# EAGLE design Comm (EAGLE 9.0.0)
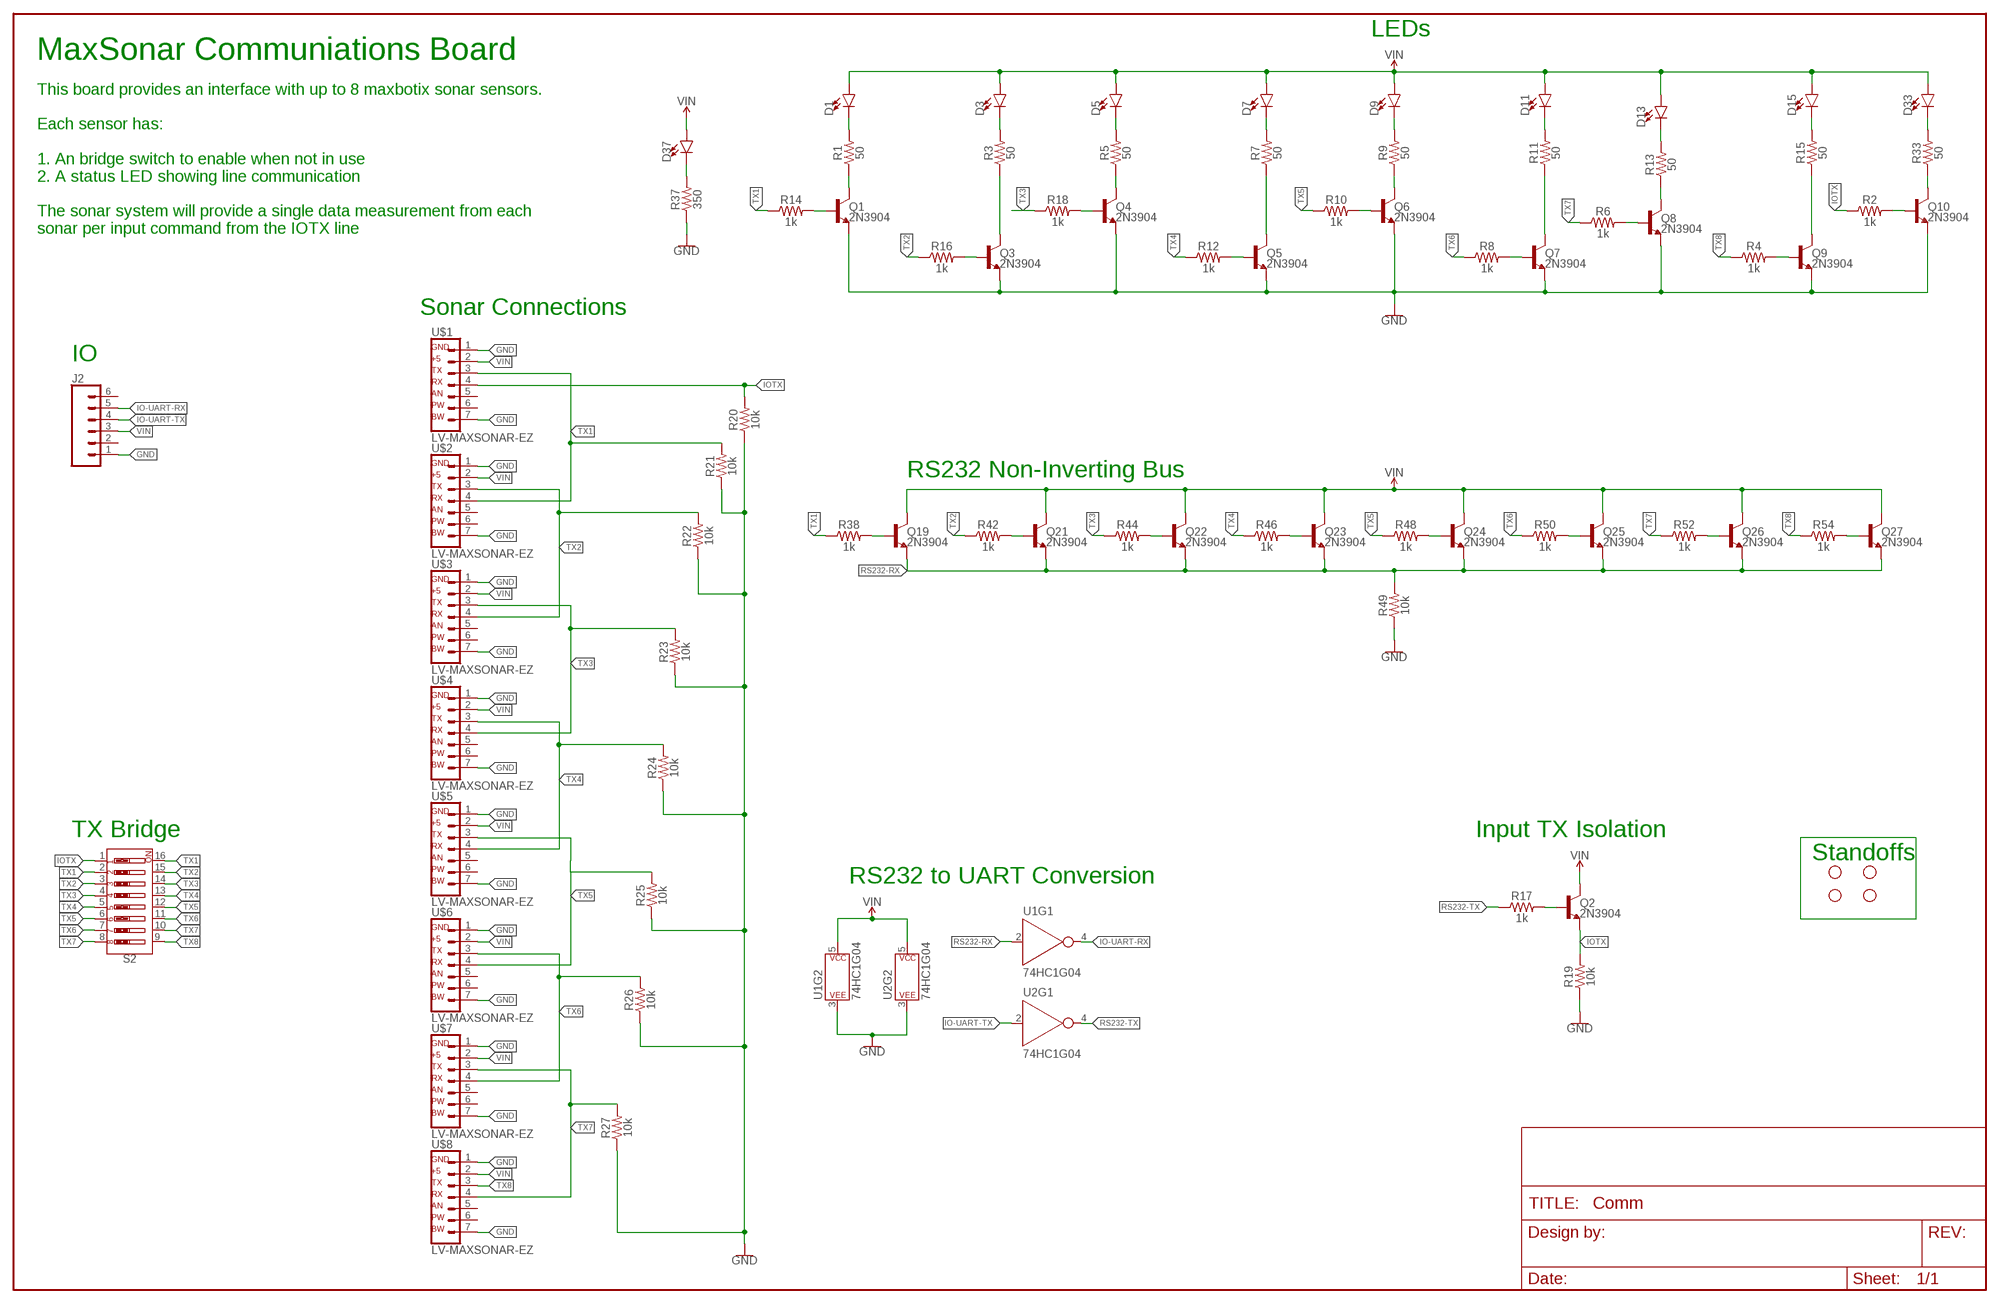
[diagram p0: schematic, sheet 1]

## Parts
D1  LED0603  [LED-0603]
D3  LED0603  [LED-0603]
D5  LED0603  [LED-0603]
D7  LED0603  [LED-0603]
D9  LED0603  [LED-0603]
D11  LED0603  [LED-0603]
D13  LED0603  [LED-0603]
D15  LED0603  [LED-0603]
D33  LED0603  [LED-0603]
D37  LED0603  [LED-0603]
FRAME1  FRAME-LEDGER  [CREATIVE_COMMONS]
H1  STAND-OFF  [STAND-OFF]
H2  STAND-OFF  [STAND-OFF]
H3  STAND-OFF  [STAND-OFF]
H4  STAND-OFF  [STAND-OFF]
J2  CONN_06POLAR  [MOLEX-1X6]
Q1  2N3904  TRANS_NPN-MMBTA42  [SOT23-3]
Q2  2N3904  TRANS_NPN-MMBTA42  [SOT23-3]
Q3  2N3904  TRANS_NPN-MMBTA42  [SOT23-3]
Q4  2N3904  TRANS_NPN-MMBTA42  [SOT23-3]
Q5  2N3904  TRANS_NPN-MMBTA42  [SOT23-3]
Q6  2N3904  TRANS_NPN-MMBTA42  [SOT23-3]
Q7  2N3904  TRANS_NPN-MMBTA42  [SOT23-3]
Q8  2N3904  TRANS_NPN-MMBTA42  [SOT23-3]
Q9  2N3904  TRANS_NPN-MMBTA42  [SOT23-3]
Q10  2N3904  TRANS_NPN-MMBTA42  [SOT23-3]
Q19  2N3904  TRANS_NPN-MMBTA42  [SOT23-3]
Q21  2N3904  TRANS_NPN-MMBTA42  [SOT23-3]
Q22  2N3904  TRANS_NPN-MMBTA42  [SOT23-3]
Q23  2N3904  TRANS_NPN-MMBTA42  [SOT23-3]
Q24  2N3904  TRANS_NPN-MMBTA42  [SOT23-3]
Q25  2N3904  TRANS_NPN-MMBTA42  [SOT23-3]
Q26  2N3904  TRANS_NPN-MMBTA42  [SOT23-3]
Q27  2N3904  TRANS_NPN-MMBTA42  [SOT23-3]
R1  50  RESISTOR0805  [0805]
R2  1k  RESISTOR0805  [0805]
R3  50  RESISTOR0805  [0805]
R4  1k  RESISTOR0805  [0805]
R5  50  RESISTOR0805  [0805]
R6  1k  RESISTOR0805  [0805]
R7  50  RESISTOR0805  [0805]
R8  1k  RESISTOR0805  [0805]
R9  50  RESISTOR0805  [0805]
R10  1k  RESISTOR0805  [0805]
R11  50  RESISTOR0805  [0805]
R12  1k  RESISTOR0805  [0805]
R13  50  RESISTOR0805  [0805]
R14  1k  RESISTOR0805  [0805]
R15  50  RESISTOR0805  [0805]
R16  1k  RESISTOR0805  [0805]
R17  1k  RESISTOR0805  [0805]
R18  1k  RESISTOR0805  [0805]
R19  10k  RESISTOR0805  [0805]
R20  10k  RESISTOR0805  [0805]
R21  10k  RESISTOR0805  [0805]
R22  10k  RESISTOR0805  [0805]
R23  10k  RESISTOR0805  [0805]
R24  10k  RESISTOR0805  [0805]
R25  10k  RESISTOR0805  [0805]
R26  10k  RESISTOR0805  [0805]
R27  10k  RESISTOR0805  [0805]
R33  50  RESISTOR0805  [0805]
R37  350  RESISTOR0805  [0805]
R38  1k  RESISTOR0805  [0805]
R42  1k  RESISTOR0805  [0805]
R44  1k  RESISTOR0805  [0805]
R46  1k  RESISTOR0805  [0805]
R48  1k  RESISTOR0805  [0805]
R49  10k  RESISTOR0805  [0805]
R50  1k  RESISTOR0805  [0805]
R52  1k  RESISTOR0805  [0805]
R54  1k  RESISTOR0805  [0805]
S2  DIP-08-PTH  [DIPSWITCH-08]
U1  74HC1G04  [SOT353]
U2  74HC1G04  [SOT353]
U$1  LV-MAXSONAR-EZ  [1X07]
U$2  LV-MAXSONAR-EZ  [1X07]
U$3  LV-MAXSONAR-EZ  [1X07]
U$4  LV-MAXSONAR-EZ  [1X07]
U$5  LV-MAXSONAR-EZ  [1X07]
U$6  LV-MAXSONAR-EZ  [1X07]
U$7  LV-MAXSONAR-EZ  [1X07]
U$8  LV-MAXSONAR-EZ  [1X07]

## Nets
GND: J2.1 Q1.2(E) Q3.2(E) Q4.2(E) Q5.2(E) Q6.2(E) Q7.2(E) Q8.2(E) Q9.2(E) Q10.2(E) R19.1 R20.1 R21.1 R22.1 R23.1 R24.1 R25.1 R26.1 R27.1 R37.1 R49.1 U1.3(P$V-) U2.3(P$V-) U$1.1(GND) U$1.7(BW) U$2.1(GND) U$2.7(BW) U$3.1(GND) U$3.7(BW) U$4.1(GND) U$4.7(BW) U$5.1(GND) U$5.7(BW) U$6.1(GND) U$6.7(BW) U$7.1(GND) U$7.7(BW) U$8.1(GND) U$8.7(BW)
IO-UART-RX: J2.5 U1.4(Y)
IO-UART-TX: J2.4 U2.2(A)
IOTX: Q2.2(E) R2.1 R19.2 R20.2 S2.1 U$1.4(RX)
N$1: D1.C R1.2
N$2: Q1.3(C) R1.1
N$3: D3.C R3.2
N$4: Q3.3(C) R3.1
N$5: D5.C R5.2
N$6: Q4.3(C) R5.1
N$7: D7.C R7.2
N$8: Q5.3(C) R7.1
N$9: D9.C R9.2
N$10: Q6.3(C) R9.1
N$11: D11.C R11.2
N$12: Q7.3(C) R11.1
N$13: D13.C R13.2
N$14: Q8.3(C) R13.1
N$15: D15.C R15.2
N$16: Q9.3(C) R15.1
N$17: Q2.1(B) R17.2
N$18: Q10.3(C) R33.1
N$20: Q10.1(B) R2.2
N$22: Q9.1(B) R4.2
N$24: Q8.1(B) R6.2
N$26: Q7.1(B) R8.2
N$28: Q6.1(B) R10.2
N$30: Q5.1(B) R12.2
N$32: Q1.1(B) R14.2
N$33: D33.C R33.2
N$34: Q3.1(B) R16.2
N$37: D37.C R37.2
N$38: Q19.1(B) R38.2
N$61: Q21.1(B) R42.2
N$63: Q4.1(B) R18.2
N$65: Q22.1(B) R44.2
N$68: Q23.1(B) R46.2
N$71: Q24.1(B) R48.2
N$74: Q25.1(B) R50.2
N$77: Q26.1(B) R52.2
N$80: Q27.1(B) R54.2
RS232-RX: Q19.2(E) Q21.2(E) Q22.2(E) Q23.2(E) Q24.2(E) Q25.2(E) Q26.2(E) Q27.2(E) R49.2 U1.2(A)
RS232-TX: R17.1 U2.4(Y)
TX1: R14.1 R21.2 R38.1 S2.2 S2.16 U$1.3(TX) U$2.4(RX)
TX2: R16.1 R22.2 R42.1 S2.3 S2.15 U$2.3(TX) U$3.4(RX)
TX3: R18.1 R23.2 R44.1 S2.4 S2.14 U$3.3(TX) U$4.4(RX)
TX4: R12.1 R24.2 R46.1 S2.5 S2.13 U$4.3(TX) U$5.4(RX)
TX5: R10.1 R25.2 R48.1 S2.6 S2.12 U$5.3(TX) U$6.4(RX)
TX6: R8.1 R26.2 R50.1 S2.7 S2.11 U$6.3(TX) U$7.4(RX)
TX7: R6.1 R27.2 R52.1 S2.8 S2.10 U$7.3(TX) U$8.4(RX)
TX8: R4.1 R54.1 S2.9 U$8.3(TX)
VIN: D1.A D3.A D5.A D7.A D9.A D11.A D13.A D15.A D33.A D37.A J2.3 Q2.3(C) Q19.3(C) Q21.3(C) Q22.3(C) Q23.3(C) Q24.3(C) Q25.3(C) Q26.3(C) Q27.3(C) U1.5(P$V+) U2.5(P$V+) U$1.2(+5) U$2.2(+5) U$3.2(+5) U$4.2(+5) U$5.2(+5) U$6.2(+5) U$7.2(+5) U$8.2(+5)
Unconnected: J2.2 J2.6 U$1.5(AN) U$1.6(PW) U$2.5(AN) U$2.6(PW) U$3.5(AN) U$3.6(PW) U$4.5(AN) U$4.6(PW) U$5.5(AN) U$5.6(PW) U$6.5(AN) U$6.6(PW) U$7.5(AN) U$7.6(PW) U$8.5(AN) U$8.6(PW)

## Notes on the sheet
- LEDs
- MaxSonar Communiations Board
- This board provides an interface with up to 8 maxbotix sonar sensors. 
  
  Each sensor has:
  
  1. An bridge switch to enable when not in use
  2. A status LED showing line communication
  
  The sonar system will provide a single data measurement from each 
  sonar per input command from the IOTX line
- Sonar Connections
- IO
- RS232 Non-Inverting Bus
- TX Bridge | Input TX Isolation
- Standoffs
- RS232 to UART Conversion

## Library data of the parts
D1 D3 D5 D7 D9 D11 D13 D15 D33 D37 = SparkFun-LED:LED: LED (Generic) Standard schematic elements and footprints for 5mm, 3mm, 1206, and 0603 sized LEDs. Generic LEDs with no color specified.
FRAME1 = SparkFun-Aesthetics:FRAME-LEDGER: Schematic Frame - Ledger Standard 11x14 US Ledger frame
H1-H4 = SparkFun-Hardware:STAND-OFF: Stand Off Drill holes for mechanically mounting via screws, standoffs, etc. Note: Use the keepout ring to avoid running the screw head into surrounding components. Variant Overviews STAND-OFF - Mechanical footprint for a #4 phillips button head screw. STAND-OFF-TIGHT - Mechanical footprint for a #4 phillips button head screw, Example SparkFun Products Screw - Phillips Head (1/4", 4-40, 10 pack) <https://www.sparkfun.com/products/10453> (PRT-10453) Screw - Phillips Head (1/2", 4-40, 10 pack) <https://www.sparkfun.com/products/10452> (PRT-10452) Screw - Phillips Head (3/4", 4-40, 10 pack) <https://www.sparkfun.com/products/10451> (PRT-10451) Screw - Phillips Head (1", 4-40, 10 pack) <https://www.sparkfun.com/products/10450> (PRT-10450)
J2 = SparkFun-Connectors:CONN_06: Multi connection point. Often used as Generic Header-pin footprint for 0.1 inch spaced/style header connections On any of the 0.1 inch spaced packages, you can populate with these: Break Away Headers - Straight <https://www.sparkfun.com/products/116> (PRT-00116) Break Away Male Headers - Right Angle <https://www.sparkfun.com/products/553> (PRT-00553) Female Headers <https://www.sparkfun.com/products/115> (PRT-00115) Break Away Headers - Machine Pin <https://www.sparkfun.com/products/117> (PRT-00117) Break Away Female Headers - Swiss Machine Pin <https://www.sparkfun.com/products/743> (PRT-00743) Arduino Stackable Header - 6 Pin <https://www.sparkfun.com/products/9280> (PRT-09280) For SCREWTERMINALS and SPRING TERMINALS visit here: Screw Terimnals on SparkFun.com <https://www.sparkfun.com/search/results?term=Screw+Terminals> (5mm/3.5mm/2.54mm spacing) This device is also useful as a general connection point to wire up your design to another part of your project. Our various solder wires solder well into these plated through hole pads. Hook-Up Wire - Assortment (Stranded, 22 AWG) <https://www.sparkfun.com/products/11375> (PRT-11375) Hook-Up Wire - Assortment (Solid Core, 22 AWG) <https://www.sparkfun.com/products/11367> (PRT-11367) View the entire wire category on our website here <https://www.sparkfun.com/categories/141>
Q1-Q10 Q19 Q21-Q27 = SparkFun-DiscreteSemi:TRANS_NPN: NPN transistor Current controlled devices typically used to amplify current or used as a switch. BC547 - COM-08928 <http://www.sparkfun.com/products/8928> (TO-92 45V 100mA) (1.Collector 2.Base 3.Emitter) 2N3904 - COM-00521 <http://www.sparkfun.com/products/521> (TO-92 40V 200mA) (1.Emitter 2.Base 3.Collector) P2N2222A - COM-12852 <http://www.sparkfun.com/products/12852> (TO-92 40V 600mA) (1.Collector 2.Base 3.Emitter); PROD_ID: TRANS-09116; VALUE: 500mA/300V
R1-R27 R33 R37 R38 R42 R44 R46 R48-R50 R52 R54 = SparkFun-Resistors:RESISTOR: Generic Resistor Package
S2 = SparkFun-Switches:DIP-08: 8-Position DIP Switch 8-circuit DIP (dual inline package) switch. Commonly used to physcially set a circuit's behavior. SparkFun Products DIP Switch - 8 Position <https://www.sparkfun.com/products/8034> (COM-08034); PROD_ID: SWCH-12197; SF_SKU: COM-08034
U1 U2 = SparkFun-IC-Logic:74*1G04: Single Inverter IC NOT GATE INVERTER SNGL 1IN SOT353 Supply: 1.65V to 5.5V Datasheet <http://diodes.com/datasheets/74LVC1G04.pdf> SparkFun Products SparkFun Stepoko <https://www.sparkfun.com/products/13899> (ROB-13899) SparkFun CryptoShield <https://www.sparkfun.com/products/13183> (DEV-13183) SparkFun LogicBlocks Kit <https://www.sparkfun.com/products/11006> (KIT-11006) SparkFun ArduMoto <https://www.sparkfun.com/products/9815> (DEV-09815); PROD_ID: COMP-08268
U$1-U$8 = Comm:LV-MAXSONAR-EZ

## Net classes
0 default: width 0.152 mm, drill 0.254 mm, clearance 0.152 mm

## Board
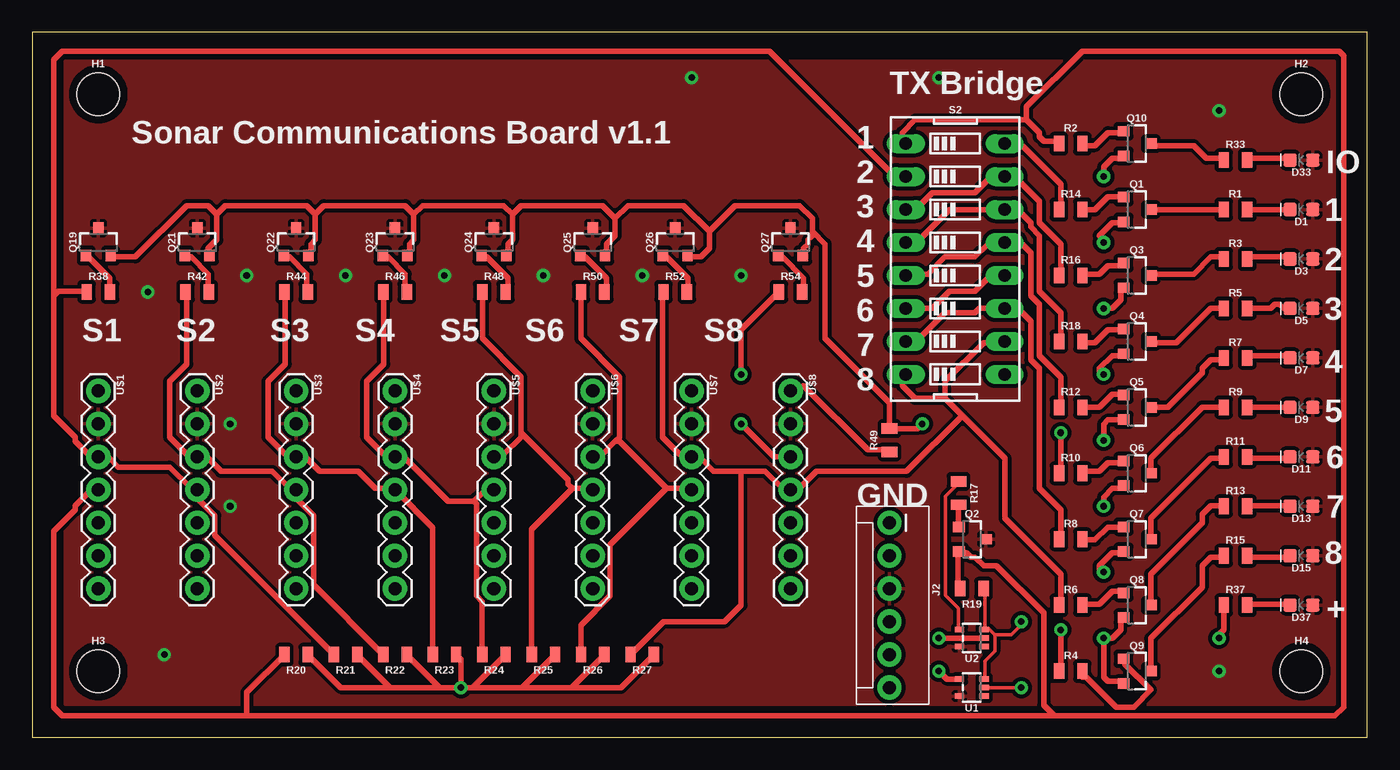
[diagram p1: board, top side]
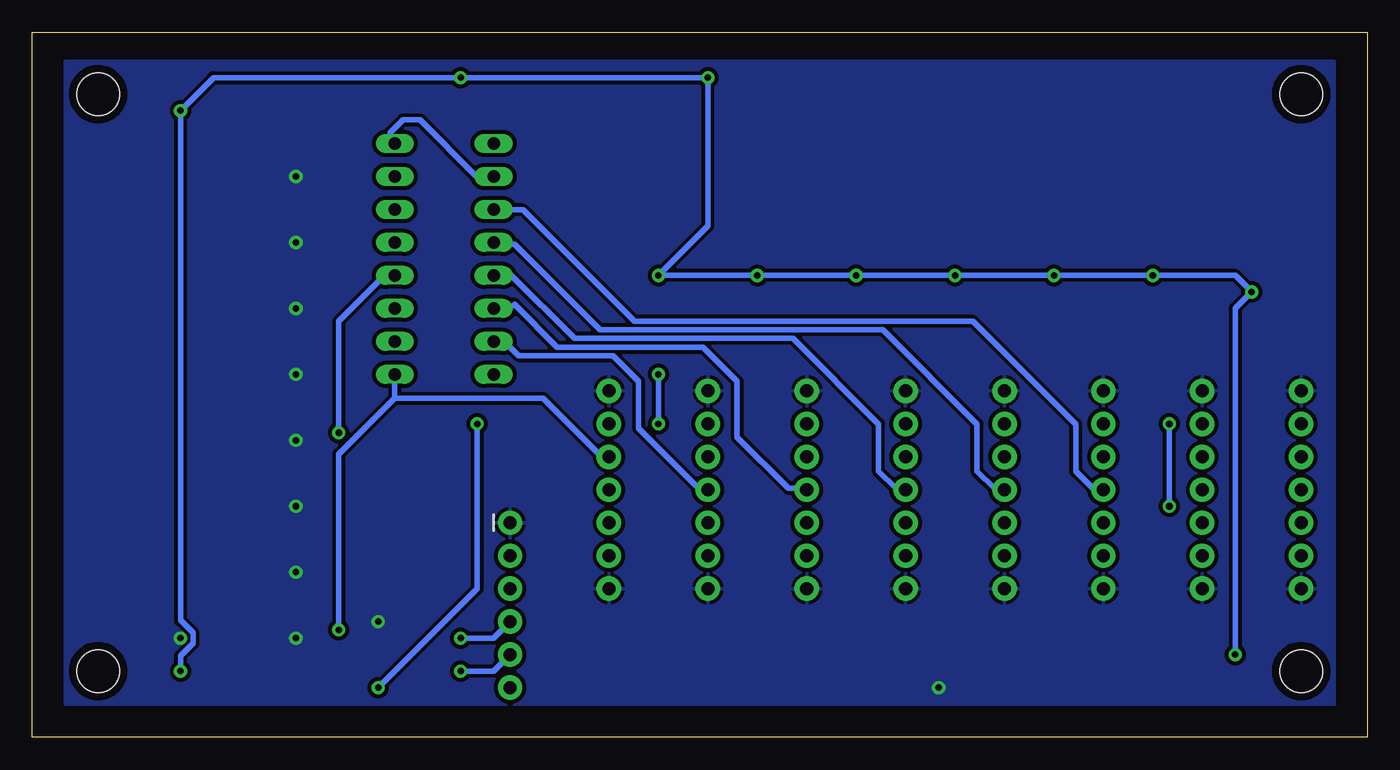
[diagram p2: board, bottom side, seen from below]

Size 102.85 x 54.28 mm. Coordinates in mm from the lower left corner, seen from the top.
Outline: 0,0 102.85,0 102.85,54.28 0,54.28 0,0
Copper layers (1*16): Top 0.035mm / dielectric 1.5mm / Bottom 0.035mm
Design rules "SparkFun-2-layer-STANDARD *": minimum track width 10mil, minimum drill 20mil, track to track 10mil, track to pad 8mil, pad to pad 8mil, via to via 10mil, smd to smd 8mil, copper to edge 8mil, drill to drill 8mil, minimum pad ring 10mil, minimum via ring 10mil, stop-mask expansion 4mil, vias tented up to drill 25mil, thermal gap 10mil

### Footprints (pad centres in the part's own frame; a part is rotated, then mirrored left to right if it is on the bottom)
LED-0603 = smd 1 x 1: A -0.877,0; C 0.877,0
STAND-OFF = hole 3.302: 0,0
MOLEX-1X6 = drill 1.016 pad 1.88: 1 0,0; 2 2.54,0; 3 5.08,0; 4 7.62,0; 5 10.16,0; 6 12.7,0
SOT23-3 = smd 0.8 x 0.9: 1 -0.95,-1; 2 0.95,-1; 3 0,1.1
0805 = smd 0.8 x 1.2: 1 -0.9,0; 2 0.9,0
DIPSWITCH-08 = drill 0.97 long: 1 -8.89,-3.81; 2 -6.35,-3.81; 3 -3.81,-3.81; 4 -1.27,-3.81; 5 1.27,-3.81; 6 3.81,-3.81; 7 6.35,-3.81; 8 8.89,-3.81; 9 8.89,3.81; 10 6.35,3.81; 11 3.81,3.81; 12 1.27,3.81; 13 -1.27,3.81; 14 -3.81,3.81; 15 -6.35,3.81; 16 -8.89,3.81
SOT353 = smd 0.42 x 0.7: 1 -0.65,-0.95; 2 0,-0.95; 3 0.65,-0.95; 4 0.65,0.95; 5 -0.65,0.95
1X07 = drill 1.016 pad 1.88: 1 0,0; 2 2.54,0; 3 5.08,0; 4 7.62,0; 5 10.16,0; 6 12.7,0; 7 15.24,0

### Placement (x,y rotation side)
D1  97.79,40.64 180 top
D3  97.79,36.83 180 top
D5  97.79,33.02 180 top
D7  97.79,29.21 180 top
D9  97.79,25.4 180 top
D11  97.79,21.59 180 top
D13  97.79,17.78 180 top
D15  97.79,13.97 180 top
D33  97.79,44.45 180 top
D37  97.79,10.16 180 top
FRAME1  99.06,40.64 180 top
H1  5.08,49.53 0 top
H2  97.79,49.53 0 top
H3  5.08,5.08 0 top
H4  97.79,5.08 0 top
J2  66.04,16.51 270 top
Q1  85.09,40.64 270 top
Q2  72.39,15.24 270 top
Q3  85.09,35.56 270 top
Q4  85.09,30.48 270 top
Q5  85.09,25.4 270 top
Q6  85.09,20.32 270 top
Q7  85.09,15.24 270 top
Q8  85.09,10.16 270 top
Q9  85.09,5.08 270 top
Q10  85.09,45.72 270 top
Q19  5.08,38.1 0 top
Q21  12.7,38.1 0 top
Q22  20.32,38.1 0 top
Q23  27.94,38.1 0 top
Q24  35.56,38.1 0 top
Q25  43.18,38.1 0 top
Q26  49.53,38.1 0 top
Q27  58.42,38.1 0 top
R1  92.71,40.64 0 top
R2  80.01,45.72 0 top
R3  92.71,36.83 0 top
R4  80.01,5.08 0 top
R5  92.71,33.02 0 top
R6  80.01,10.16 0 top
R7  92.71,29.21 0 top
R8  80.01,15.24 0 top
R9  92.71,25.4 0 top
R10  80.01,20.32 0 top
R11  92.71,21.59 0 top
R12  80.01,25.4 0 top
R13  92.71,17.78 0 top
R14  80.01,40.64 0 top
R15  92.71,13.97 0 top
R16  80.01,35.56 0 top
R17  71.37,18.8 270 top
R18  80.01,30.48 0 top
R19  72.39,11.43 180 top
R20  20.32,6.35 180 top
R21  24.13,6.35 180 top
R22  27.94,6.35 180 top
R23  31.75,6.35 180 top
R24  35.56,6.35 180 top
R25  39.37,6.35 180 top
R26  43.18,6.35 180 top
R27  46.99,6.35 180 top
R33  92.71,44.45 0 top
R37  92.71,10.16 0 top
R38  5.08,34.29 0 top
R42  12.7,34.29 0 top
R44  20.32,34.29 0 top
R46  27.94,34.29 0 top
R48  35.56,34.29 0 top
R49  66.04,22.86 90 top
R50  43.18,34.29 0 top
R52  49.53,34.29 0 top
R54  58.42,34.29 0 top
S2  71.12,36.83 270 top
U1  72.39,3.81 90 top
U2  72.39,7.62 90 top
U$1  5.08,26.67 270 top
U$2  12.7,26.67 270 top
U$3  20.32,26.67 270 top
U$4  27.94,26.67 270 top
U$5  35.56,26.67 270 top
U$6  43.18,26.67 270 top
U$7  50.8,26.67 270 top
U$8  58.42,26.67 270 top

### Tracks (layer width: path | path; a pad name or v marks a point on that pad's centre or on a via)
GND  (via drill 0.51)
  Top 0.254: 74.17,7.87 74.17,6.6 73.41,5.84 73.41,4.57 U1.3 | 74.17,7.87 73.66,8.38 73.41,8.38 | 73.41,8.38 73.41,11.18 R19.1 | 73.41,8.38 U2.3 | 74.17,7.87 75.44,7.87 76.2,8.64 v76.2,8.89
  Top 0.406: 82.55,7.59 82.55,4.62 82.88,4.29 83.87,4.29 Q9.2 | 82.55,7.59 83.21,7.59 83.87,8.26 83.87,8.91 Q8.2 | 82.55,7.59 v82.55,7.62 | Q7.2 83.87,14.2 83.21,14.2 82.22,13.21 82.22,12.88 82.55,12.55 v82.55,12.7 | v82.55,17.78 82.55,18.49 83.21,19.15 83.87,19.15 Q6.2 | v82.55,22.86 82.55,24.11 82.88,24.43 83.87,24.43 Q5.2 | Q4.2 83.87,29.39 83.21,29.39 82.22,28.4 82.22,28.07 82.55,27.74 v82.55,27.94 | v82.55,33.02 83.21,33.02 83.87,33.68 83.87,34.34 Q3.2 | Q1.2 83.87,39.62 83.21,39.62 82.22,38.63 82.55,38.3 v82.55,38.1 | v82.55,43.18 82.55,43.92 83.21,44.58 83.87,44.58 Q10.2 | R49.1 66.04,22.12 64.39,22.12 59.44,27.08 59.11,26.75 58.45,26.75 U$8.1 | R37.1 91.8,9.91 91.8,8.26 91.47,7.92 v91.44,7.62 | 76.28,8.59 v76.2,8.89 | 73.3,11.23 R19.1 | R23.1 33.02,5.98 v33.02,3.81 | R24.1 33.92,3.81 | 33.92,3.81 v33.02,3.81 | R25.1 37.73,3.81 | 37.73,3.81 33.92,3.81 | R26.1 41.54,3.81 | 41.54,3.81 37.73,3.81 | R27.1 45.35,3.81 41.54,3.81 | R22.1 31.38,3.81 | 31.38,3.81 v33.02,3.81 | R21.1 27.57,3.81 | 27.57,3.81 31.38,3.81 | R20.1 23.76,3.81 27.57,3.81
  pour Bottom (isolate 0.305): 2.54,52.07 100.33,52.07 100.33,2.54 2.54,2.54
IO-UART-RX  (via drill 0.51)
  Top 0.406: v69.85,5.08 70.47,4.46 U1.4
  Bottom 0.406: J2.5 67.31,5.08 v69.85,5.08
IO-UART-TX  (via drill 0.51)
  Top 0.406: U2.2 v69.85,7.62
  Bottom 0.406: J2.4 67.31,7.62 v69.85,7.62
IOTX
  Top 0.406: 76.61,47.55 77.6,46.56 77.6,46.23 77.93,45.9 78.92,45.9 R2.1 | 76.61,47.55 68.02,47.55 67.03,46.56 67.03,45.9 S2.1 | R19.2 71.32,11.56 71.32,14.2 Q2.2 71.65,14.2 71.98,14.2 72.31,13.87 72.64,13.87 73.3,13.21 74.3,13.21 77.93,9.58 77.93,2.46 78.74,1.65 | 16.51,1.65 2.31,1.65 1.65,2.31 1.65,15.85 3.3,17.5 3.3,17.83 4.29,18.82 4.95,18.82 U$1.4 | 16.51,1.65 78.74,1.65 | 78.74,1.65 100.38,1.65 101.04,2.31 101.04,52.5 100.71,52.83 80.9,52.83 76.61,48.54 76.61,47.55 | R20.2 16.51,3.44 16.51,1.65
N$1
  Top 0.406: D1.C 96.75,40.62 93.78,40.62 R1.2
N$2
  Top 0.406: Q1.3 86.51,40.62 91.8,40.62 R1.1
N$3
  Top 0.406: D3.C 96.75,36.98 93.78,36.98 R3.2
N$4
  Top 0.406: Q3.3 86.51,35.66 89.48,35.66 90.81,36.98 91.8,36.98 R3.1
N$5
  Top 0.406: D5.C 96.42,33.02 96.09,33.35 95.76,33.35 95.43,33.02 R5.2
N$6
  Top 0.406: R5.1 90.81,33.02 88.16,30.38 86.51,30.38 Q4.3
N$7
  Top 0.406: D7.C 96.75,29.39 93.78,29.39 R7.2
N$8
  Top 0.406: Q5.3 86.51,25.43 87.5,25.43 90.14,28.07 90.14,28.4 90.81,29.06 91.8,29.06 R7.1
N$9
  Top 0.406: D9.C 96.75,25.43 93.78,25.43 R9.2
N$10
  Top 0.406: Q6.3 86.18,20.47 86.18,21.46 90.14,25.43 91.8,25.43 R9.1
N$11
  Top 0.406: D11.C 96.75,21.46 93.78,21.46 R11.2
N$12
  Top 0.406: Q7.3 86.18,15.52 86.18,16.84 90.81,21.46 91.8,21.46 R11.1
N$13
  Top 0.406: D13.C 96.75,17.83 93.78,17.83 R13.2
N$14
  Top 0.406: Q8.3 86.18,10.24 86.18,12.55 90.14,16.51 90.14,17.17 90.81,17.83 91.8,17.83 R13.1
N$15
  Top 0.406: D15.C 96.75,13.87 93.78,13.87 R15.2
N$16
  Top 0.406: Q9.3 86.18,5.28 86.18,7.59 90.14,11.56 90.14,13.21 90.81,13.87 91.8,13.87 R15.1
N$17
  Top 0.406: R17.2 71.37,16.21 Q2.1
N$18
  Top 0.406: Q10.3 86.51,45.57 89.48,45.57 90.47,44.58 91.8,44.58 R33.1
N$20
  Top 0.406: Q10.1 83.87,46.56 82.88,46.56 81.89,45.57 81.23,45.57 R2.2
N$22
  Top 0.406: Q9.1 84.2,5.94 84.2,5.61 86.18,3.63 84.86,2.31 83.54,2.31 81.23,4.62 80.9,4.62 80.9,4.95 R4.2
N$24
  Top 0.406: Q8.1 83.87,11.23 83.21,11.23 82.22,10.24 81.23,10.24 R6.2
N$26
  Top 0.406: Q7.1 83.87,16.18 82.88,16.18 81.89,15.19 81.23,15.19 R8.2
N$28
  Top 0.406: Q6.1 83.87,21.13 82.88,21.13 82.22,20.47 81.23,20.47 R10.2
N$30
  Top 0.406: Q5.1 83.87,26.42 83.21,26.42 82.22,25.43 81.23,25.43 R12.2
N$32
  Top 0.406: Q1.1 83.87,41.6 82.88,41.6 81.89,40.62 81.23,40.62 R14.2
N$33
  Top 0.406: D33.C 96.75,44.58 93.78,44.58 R33.2
N$34
  Top 0.406: Q3.1 83.87,36.32 82.88,36.32 82.22,35.66 81.23,35.66 R16.2
N$37
  Top 0.406: D37.C 96.75,10.24 93.78,10.24 R37.2
N$38
  Top 0.406: Q19.1 4.29,36.98 5.94,35.33 5.94,34.34 R38.2
N$61
  Top 0.406: Q21.1 11.89,36.98 12.22,36.98 13.54,35.66 13.54,34.34 R42.2
N$63
  Top 0.406: Q4.1 83.87,31.37 82.88,31.37 81.89,30.38 81.23,30.38 R18.2
N$65
  Top 0.406: Q22.1 19.48,36.98 19.81,36.98 21.13,35.66 21.13,34.34 R44.2
N$68
  Top 0.406: Q23.1 27.08,36.98 27.41,36.98 28.73,35.66 28.73,34.34 R46.2
N$71
  Top 0.406: Q24.1 34.67,36.98 35,36.98 36.65,35.33 36.65,34.34 R48.2
N$74
  Top 0.406: Q25.1 42.27,36.98 42.6,36.98 44.25,35.33 44.25,34.34 R50.2
N$77
  Top 0.406: Q26.1 48.87,36.98 50.52,35.33 50.52,34.34 R52.2
N$80
  Top 0.406: Q27.1 57.78,36.98 59.44,35.33 59.44,34.34 R54.2
RS232-RX  (via drill 0.51)
  Top 0.254: v76.2,3.81 U1.2
  Top 0.406: 14.2,40.28 13.54,40.95 11.89,40.95 7.92,36.98 6.27,36.98 Q19.2 | 14.2,40.28 14.2,38.3 13.54,37.64 13.54,37.31 Q21.2 | 21.79,40.28 21.79,38.3 21.46,37.97 21.46,37.31 Q22.2 | 21.79,40.28 21.13,40.95 14.86,40.95 14.2,40.28 | 29.39,40.28 29.39,38.3 29.06,37.97 29.06,37.31 Q23.2 | 29.39,40.28 28.73,40.95 22.45,40.95 21.79,40.28 | 36.98,40.28 36.98,38.3 36.65,37.97 36.65,37.31 Q24.2 | 36.98,40.28 36.32,40.95 30.05,40.95 29.39,40.28 | 44.91,39.95 44.91,38.63 44.25,37.97 44.25,37.31 Q25.2 | 44.91,39.95 43.92,40.95 37.64,40.95 36.98,40.28 | 52.17,38.96 52.17,37.64 51.51,36.98 50.52,36.98 Q26.2 | 52.17,38.96 50.19,40.95 45.9,40.95 44.91,39.95 | 60.1,38.96 60.1,39.95 59.11,40.95 54.15,40.95 52.17,38.96 | 60.1,38.96 60.1,38.63 59.77,38.3 59.77,37.97 59.44,37.64 59.44,37.31 Q27.2 | 60.1,38.96 61.09,37.97 61.09,30.71 66.04,25.76 R49.2 68.21,23.76 v68.58,24.13
  Bottom 0.406: v68.58,24.13 68.58,11.43 v76.2,3.81
RS232-TX
  Top 0.254: U2.4 71.37,8.38 71.37,9.91 70.36,10.92 70.36,18.54 71.37,19.56 R17.1
TX1
  Top 0.406: R14.1 79.25,40.95 79.25,42.6 76.28,45.57 74.95,45.57 S2.16 | 1.65,34.01 1.98,34.34 3.96,34.34 R38.1 | 1.65,34.01 1.65,24.77 3.3,23.11 3.3,22.78 4.29,21.79 4.95,21.79 U$1.3 5.28,21.46 5.94,21.46 6.6,20.8 10.57,20.8 12.22,19.15 12.55,19.15 U$2.4 12.7,18.41 14.05,17.07 14.05,15.53 R21.2 | 1.65,34.01 1.65,52.17 2.31,52.83 56.79,52.83 66.37,43.26 67.03,43.26 S2.2
  Bottom 0.406: S2.2 67.36,43.26 68.68,43.26 72.97,47.55 74.3,47.55 75.29,46.56 75.29,46.23 74.95,45.9 S2.16
TX2
  Top 0.406: R16.1 79.25,35.66 79.25,37.97 77.6,39.62 77.6,41.27 75.95,42.93 74.95,42.93 S2.15 74.62,42.93 73.64,42.93 72.64,41.94 69.34,41.94 68.35,40.95 67.36,40.95 S2.3 | R42.1 11.89,34.01 11.89,28.73 10.57,27.41 10.57,23.11 11.89,21.79 12.55,21.79 U$2.3 12.88,21.46 13.54,21.46 14.53,20.47 18.49,20.47 19.81,19.15 20.14,19.15 U$3.4 20.32,18.41 21.67,17.07 21.67,11.72 R22.2
  Bottom 0.406: S2.3 67.03,40.62 65.05,40.62 56.46,32.03 30.38,32.03 22.45,24.11 22.45,20.47 21.13,19.15 20.47,19.15 U$3.4
TX3
  Top 0.406: R18.1 79.25,30.71 79.25,32.69 77.6,34.34 77.6,38.63 76.94,39.29 76.94,39.62 75.95,40.62 74.95,40.62 S2.14 74.62,40.62 70.66,40.62 68.35,38.3 67.36,38.3 S2.4 | R44.1 19.48,34.01 19.48,28.73 18.16,27.41 18.16,23.11 19.48,21.79 20.14,21.79 U$3.3 20.47,21.46 21.13,21.46 22.12,20.47 25.09,20.47 26.42,19.15 27.74,19.15 U$4.4 30.85,16.14 R23.2
  Bottom 0.406: S2.4 67.03,37.97 65.71,37.97 59.11,31.37 37.31,31.37 30.05,24.11 30.05,20.47 28.73,19.15 28.07,19.15 U$4.4
TX4
  Top 0.406: R12.1 79.25,25.43 79.25,27.74 77.6,29.39 77.6,33.35 76.94,34.01 76.94,37.31 76.28,37.97 74.95,37.97 S2.13 74.62,37.97 73.64,37.97 72.64,36.98 70.33,36.98 69.01,35.66 67.36,35.66 S2.5 | R46.1 27.08,34.01 27.08,28.73 25.76,27.41 25.76,23.11 27.08,21.79 27.74,21.79 U$4.3 28.07,21.46 28.73,21.46 32.03,18.16 34.01,18.16 | 34.01,18.16 34.67,18.82 35.33,18.82 U$5.4 | R24.2 34.66,10.43 34.21,10.87 34.21,17.96 34.01,18.16
  Bottom 0.406: S2.5 67.03,35.66 66.04,35.66 61.09,30.71 44.25,30.71 37.64,24.11 37.64,20.47 36.32,19.15 35.66,19.15 U$5.4
TX5  (via drill 0.51)
  Top 0.406: 37.64,23.44 37.64,23.11 36.32,21.79 35.66,21.79 U$5.3 | 37.64,23.44 37.64,27.74 34.67,30.71 34.67,34.01 R48.1 | 41.6,19.15 42.93,19.15 U$6.4 | 41.6,19.15 41.27,19.48 41.27,19.81 37.64,23.44 | v79.25,23.44 79.25,20.47 R10.1 | S2.6 69.34,33.02 70.66,34.34 72.64,34.34 73.64,35.33 74.62,35.33 S2.12 | R25.2 38.47,16.02 41.6,19.15
  Bottom 0.406: v79.25,23.44 79.25,32.03 75.95,35.33 74.95,35.33 S2.12 | S2.6 66.04,33.02 65.71,33.35 62.41,30.05 51.18,30.05 48.54,27.41 48.54,23.11 44.58,19.15 43.26,19.15 U$6.4
TX6
  Top 0.406: 44.91,22.78 43.92,21.79 43.26,21.79 U$6.3 | 44.91,22.78 45.24,23.11 45.24,27.74 42.27,30.71 42.27,34.01 R50.1 | 48.87,19.15 50.52,19.15 U$7.4 | 48.87,19.15 45.24,22.78 44.91,22.78 | R8.1 79.25,15.52 79.25,17.5 77.6,19.15 77.6,28.4 76.94,29.06 76.94,32.03 75.95,33.02 S2.11 72.97,33.02 72.64,32.69 70.33,32.69 68.35,30.71 67.36,30.71 S2.7 | R26.2 42.28,8.63 44.53,10.87 44.53,14.81 48.87,19.15
  Bottom 0.406: U$7.4 50.85,19.15 51.51,19.15 56.13,23.77 56.13,27.41 58.12,29.39 65.38,29.39 66.37,30.38 67.03,30.38 S2.7
TX7
  Top 0.406: R52.1 48.54,34.01 48.54,23.11 49.86,21.79 50.52,21.79 U$7.3 50.85,21.46 51.51,21.46 52.5,20.47 54.61,20.47 | 54.61,20.47 56.46,20.47 57.78,19.15 58.12,19.15 U$8.4 58.45,19.15 59.11,19.15 60.43,20.47 67.36,20.47 71.65,24.77 | 70.33,26.09 71.65,24.77 | 71.65,24.77 74.95,21.46 74.95,16.84 79.25,12.55 79.25,10.24 R6.1 | 70.33,26.09 68.02,26.09 67.03,27.08 67.03,27.74 S2.8 | 70.33,26.09 70.33,27.41 73.3,30.38 74.62,30.38 S2.10 | R27.2 48.63,8.89 53.34,8.89 54.61,10.16 54.61,20.47
TX8  (via drill 0.51)
  Top 0.406: v79.25,8.26 79.25,5.28 R4.1 | U$8.3 57.15,21.59 v54.61,24.13 | v54.61,27.94 54.61,31.38 R54.1
  Bottom 0.406: v79.25,8.26 79.25,21.79 74.95,26.09 | 74.95,26.09 74.95,27.74 S2.9 | 74.95,26.09 63.5,26.09 59,21.59 U$8.3 | v54.61,24.13 v54.61,27.94
VIN  (via drill 0.51)
  Bottom 0.406: v15.24,17.78 v15.24,24.13 | v91.44,5.08 91.44,6.25 90.47,7.22 90.47,8.02 91.44,8.98 v91.44,48.26 88.9,50.8 v69.85,50.8 v50.8,50.8 50.8,39.37 v54.61,35.56 v46.99,35.56 v39.37,35.56 v31.75,35.56 v24.13,35.56 v16.51,35.56 10.16,35.56 v8.89,34.29 10.16,33.02 v10.16,6.35
  pour Top (isolate 0.305): 2.54,52.07 100.33,52.07 100.33,2.54 2.54,2.54

### Text on the board
tPlace: TX Bridge | Sonar Communications Board v1.1 | IO | 1 | 2 | 3 | S1 S2 S3 S4 S5 S6 S7 S8 | 4 | 1 / 2 / 3 / 4 / 5 / 6 / 7 / 8 | 5 | 6 | GND | 7 | 8 | +